# Altium schematic sheet 06.SchDoc
size 297 x 209 mm
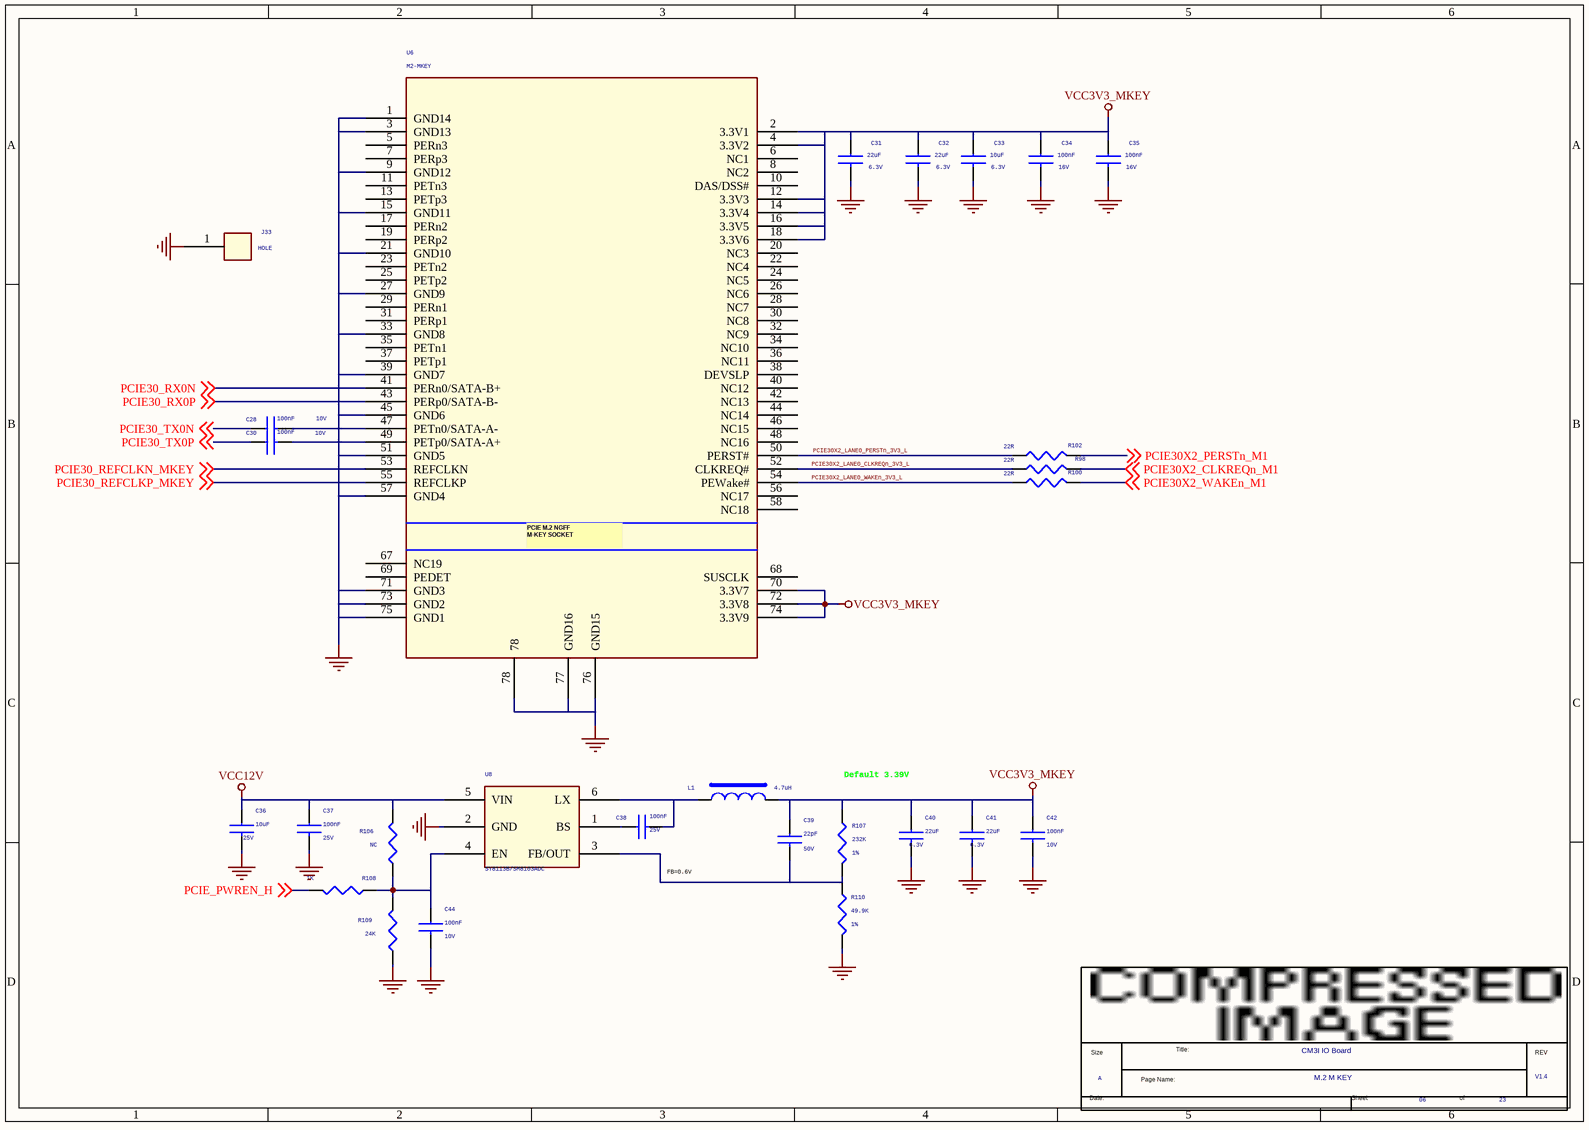
[diagram p0: 06.SchDoc]

## Parts
*  Page Count: 23  Page Number: 06  Page Size: A  Title: CM3I IO Board  RevCode: V1.4  Doc: M.2 M KEY  (hidden comment: radxa_1010)  (graphical)
C28  100nF  Voltage: 10V  [C0402]
C30  100nF  Voltage: 10V  [C0402]
C31  22uF  Voltage: 6.3V  [C0603]
C32  22uF  Voltage: 6.3V  [C0603]
C33  10uF  Voltage: 6.3V  [C0603]
C34  100nF  Voltage: 16V  [C0402]
C35  100nF  Voltage: 16V  [C0402]
C36  10uF  Voltage: 25V  [C1206]
C37  100nF  Voltage: 25V  [C0402]
C38  100nF  Voltage: 25V  [C0402]
C39  22pF  Voltage: 50V  [C0402]
C40  22uF  Voltage: 6.3V  [C0603]
C41  22uF  Voltage: 6.3V  [C0603]
C42  100nF  Voltage: 10V  [C0402]
C44  100nF  Voltage: 10V  [C0402]
J33  HOLE  [HOLE_5D5X2D7MM]
L1  4.7uH  [IND-4X4]
R98  22R  [R0402]
R100  22R  [R0402]
R102  22R  [R0402]
R106  NC  [R0402]
R107  232K  Tolerance: 1%  [R0402]
R108  1K  [R0402]
R109  24K  [R0402]
R110  49.9K  Tolerance: 1%  [R0402]
U6  M2-MKEY  [M2_NGFF_KEY_M_1]
U8  SY8113B/SM8103ADC  [SOT_23_6]

## Nets
GND: C31.2 C32.2 C33.2 C34.2 C35.2 C36.2 C37.2 C40.2 C41.2 C42.2 C44.2 J33.1 R109.2 R110.2 U6.1(GND14) U6.3(GND13) U6.9(GND12) U6.15(GND11) U6.21(GND10) U6.27(GND9) U6.33(GND8) U6.39(GND7) U6.45(GND6) U6.51(GND5) U6.57(GND4) U6.71(GND3) U6.73(GND2) U6.75(GND1) U6.76(GND15) U6.77(GND16) U6.78 U8.2(GND)
VCC3V3_MKEY: C31.1 C32.1 C33.1 C34.1 C35.1 C39.1 C40.1 C41.1 C42.1 L1.2 R107.1 U6.2(3.3V1) U6.4(3.3V2) U6.12(3.3V3) U6.14(3.3V4) U6.16(3.3V5) U6.18(3.3V6) U6.70(3.3V7) U6.72(3.3V8) U6.74(3.3V9)
VCC12V: C36.1 C37.1 R106.1 U8.5(VIN)
PCIE30_REFCLKN_MKEY: U6.53(REFCLKN) ; off-sheet PCIE30_REFCLKN_MKEY
PCIE30_REFCLKP_MKEY: U6.55(REFCLKP) ; off-sheet PCIE30_REFCLKP_MKEY
PCIE30_RX0N: U6.41(PERn0/SATA-B+) ; off-sheet PCIE30_RX0N
PCIE30_RX0P: U6.43(PERp0/SATA-B-) ; off-sheet PCIE30_RX0P
PCIE30_TX0N: C28.1 ; off-sheet PCIE30_TX0N
PCIE30_TX0P: C30.1 ; off-sheet PCIE30_TX0P
PCIE30X2_CLKREQn_M1: R98.1 ; off-sheet PCIE30X2_CLKREQn_M1
PCIE30X2_LANE0_CLKREQn_3V3_L: R98.2 U6.52(CLKREQ#)
PCIE30X2_LANE0_PERSTn_3V3_L: R102.2 U6.50(PERST#)
PCIE30X2_LANE0_WAKEn_3V3_L: R100.2 U6.54(PEWake#)
PCIE30X2_PERSTn_M1: R102.1 ; off-sheet PCIE30X2_PERSTn_M1
PCIE30X2_WAKEn_M1: R100.1 ; off-sheet PCIE30X2_WAKEn_M1
PCIE_PWREN_H: R108.1 ; off-sheet PCIE_PWREN_H
NetC28_2: C28.2 U6.47(PETn0/SATA-A-)
NetC30_2: C30.2 U6.49(PETp0/SATA-A+)
NetC38_1: C38.1 U8.1(BS)
NetC38_2: C38.2 L1.1 U8.6(LX)
NetC39_2: C39.2 R107.2 R110.1 U8.3(FB/OUT)
NetC44_1: C44.1 R106.2 R108.2 R109.1 U8.4(EN)

Not connected (* = marked no-connect by the designer): U6 5(PERn3) 6(NC1) 7(PERp3) 8(NC2) 10(DAS/DSS#) 11(PETn3) 13(PETp3) 17(PERn2) 19(PERp2) 20(NC3) 22(NC4) 23(PETn2) 24(NC5) 25(PETp2) 26(NC6) 28(NC7) 29(PERn1) 30(NC8) 31(PERp1) 32(NC9) 34(NC10) 35(PETn1) 36(NC11) 37(PETp1) 38(DEVSLP) 40(NC12) 42(NC13) 44(NC14) 46(NC15) 48(NC16) 56(NC17) 58(NC18) 67(NC19) 68(SUSCLK) 69(PEDET)

## Notes on the sheet
- Default 3.39V
- FB=0.6V
- (in symbol M_5.2 NGFF EKEY SOCKET) PCIE M.2 NGFF / M-KEY SOCKET
- (in symbol radxa_1010) Title:; Size; REV; Page Name:; Date:; Sheet; of

## Library data of the parts
C28 = CAP NP_0: cap,100.00nF,+/-10%,10V,X5R,C0201; Manufacturer: TDK; RK PN: C0603X5R1A104K030BC; Priority: A; Tolerance: 10%; Dielectric: X5R; Part Type: C0201; Manufacturer PN: C0603X5R1A104K030BC; Created by: JJJ
C30 = CAP NP_0: cap,100.00nF,+/-10%,10V,X5R,C0201; Manufacturer PN: C0603X5R1A104K030BC; Manufacturer: TDK; Tolerance: 10%; Priority: A; Dielectric: X5R; Created by: JJJ; Part Type: C0201; RK PN: C0603X5R1A104K030BC
C31 = CAP NP_0: cap,22.00uF,+/-20%,6.3V,X5R,C0603; Manufacturer PN: C1608X5R0J226M080AC; Manufacturer: TDK; Tolerance: 20%; Priority: A; Dielectric: X5R; Created by: JJJ; Part Type: C0603; RK PN: C1608X5R0J226M080AC
C32 = CAP NP_0: cap,22.00uF,+/-20%,6.3V,X5R,C0603; Manufacturer: TDK; RK PN: C1608X5R0J226M080AC; Priority: A; Tolerance: 20%; Dielectric: X5R; Part Type: C0603; Manufacturer PN: C1608X5R0J226M080AC; Created by: JJJ
C33 = CAP NP_0: cap,10.00uF,+/-10%,6.3V,X5R,C0603; Manufacturer: TDK; RK PN: C1608X5R0J106K080AB; Priority: A; Tolerance: 10%; Dielectric: X5R; Part Type: C0603; Manufacturer PN: C1608X5R0J106K080AB; Created by: JJJ
C34 = CAP NP_0: cap,100.00nF,+/-10%,16V,X5R,C0402; Manufacturer: TDK; RK PN: C1005X5R1C104K050BA; Priority: A; Tolerance: 10%; Dielectric: X5R; Part Type: C0402; Manufacturer PN: C1005X5R1C104K050BA; Created by: JJJ
C35 = CAP NP_0: cap,100.00nF,+/-10%,16V,X5R,C0402; Manufacturer PN: C1005X5R1C104K050BA; Manufacturer: TDK; Tolerance: 10%; Priority: A; Dielectric: X5R; Created by: JJJ; Part Type: C0402; RK PN: C1005X5R1C104K050BA
C36 = CAP NP_0: cap,10.00uF,+/-10%,25V,X5R,C1206; Manufacturer PN: C3216X5R1E106K085AC; Manufacturer: TDK; Tolerance: 10%; C_Voltage: 6.3V; Priority: A; Dielectric: X5R; Created by: JJJ; Part Type: C1206; RK PN: C3216X5R1E106K085AC
C37 = CAP NP_0: cap,100.00nF,+/-10%,25V,X5R,C0402; Manufacturer: TDK; RK PN: C1005X5R1E104K050BC; Priority: A; Tolerance: 10%; Dielectric: X5R; Part Type: C0402; Manufacturer PN: C1005X5R1E104K050BC; Created by: JJJ
C38 = CAP NP_0: cap,100.00nF,+/-10%,25V,X5R,C0402; Manufacturer PN: C1005X5R1E104K050BC; Manufacturer: TDK; C_Voltage: 6.3V; Tolerance: 10%; Priority: A; Number: 37; Dielectric: X5R; Created by: JJJ; Part Type: C0402; RK PN: C1005X5R1E104K050BC
C39 = CAP NP_0: cap,22.00pF,+/-5%,50V,C0G,C0402; Manufacturer: TDK; Manufacturer PN: C1005C0G1H220J050BA; Tolerance: 5%; Priority: A; Dielectric: C0G; Created by: JJJ; Part Type: C0402; RK PN: C1005C0G1H220J050BA
C40 = CAP NP_0: cap,22.00uF,+/-10%,10V,X5R,C0805; Manufacturer: TDK; RK PN: C2012X5R1A226K125AB; Priority: A; Tolerance: 10%; Dielectric: X5R; Part Type: C0805; C_Voltage: 6.3V; Manufacturer PN: C2012X5R1A226K125AB; Created by: JJJ
C41 = CAP NP_0: cap,22.00uF,+/-10%,10V,X5R,C0805; Manufacturer PN: C2012X5R1A226K125AB; Manufacturer: TDK; Tolerance: 10%; Priority: A; Dielectric: X5R; Created by: JJJ; C_Voltage: 6.3V; Part Type: C0805; RK PN: C2012X5R1A226K125AB
C42 C44 = CAP NP_0: cap,100.00nF,+/-10%,10V,X5R,C0402; Manufacturer PN: C1005X5R1A104K050BA; Manufacturer: TDK; C_Voltage: 6.3V; Tolerance: 10%; Priority: A; Number: 37; Dielectric: X5R; Created by: JJJ; Part Type: C0402; RK PN: C1005X5R1A104K050BA
J33 = CON1
L1 = INDUCTORS OF FERRITE_Dup1: Power Inductor,4.7uH,0.2,IND_606045; Manufacturer: sunlord; DC Resistor: 0.02ohm; Isat: 4.97A; RK PN: SWPA6045S4R7MT; Priority: A; Tolerance: 20%; Irms: 3.3A; Resonace frequency: 24M; Part Type: POWER_IND; Manufacturer PN: SWPA6045S4R7MT; Created by: YWQ
R98 = RESISTOR_0_Dup1: 通用厚膜电阻,22R,+/-5%,R0402,1/16W.; Manufacturer: YAGEO; Tolerance: 5%; RK PN: RC0402JR-0722RL; Priority: A; Wattage: 1/16W; Part Type: 通用厚膜电阻; Manufacturer PN: RC0402JR-0722RL; Created by: YTL
R100 R102 = RESISTOR_0_Dup1: 通用厚膜电阻,22R,+/-5%,R0402,1/16W.; Manufacturer PN: RC0402JR-0722RL; Manufacturer: YAGEO; Tolerance: 5%; Wattage: 1/16W; Priority: A; Created by: YTL; Part Type: 通用厚膜电阻; RK PN: RC0402JR-0722RL
R106 R109 = RESISTOR_0_Dup1: 通用厚膜电阻,24K,+/-5%,R0402,1/16W.; Manufacturer PN: RC0402JR-0724KL; Manufacturer: YAGEO; Tolerance: 5%; Wattage: 1/16W; Priority: A; Created by: YTL; Part Type: 通用厚膜电阻; RK PN: RC0402JR-0724KL
R107 = RESISTOR_0_Dup1: 通用厚膜电阻,232K,+/-1%,R0402,1/16W.; Manufacturer PN: RC0402FR-07232KL; Manufacturer: YAGEO; Wattage: 1/16W; Priority: A; Created by: YTL; Part Type: 通用厚膜电阻; RK PN: RC0402FR-07232KL
R108 = RESISTOR_0_Dup1: 通用厚膜电阻,100K,+/-5%,R0402,1/16W.; Manufacturer: YAGEO; Tolerance: 5%; RK PN: RC0402JR-07100KL; Priority: A; Wattage: 1/16W; Part Type: 通用厚膜电阻; Manufacturer PN: RC0402JR-07100KL; Created by: YTL
R110 = RESISTOR_0_Dup1: 通用厚膜电阻,49K9,+/-1%,R0402,1/16W.; Manufacturer PN: RC0402FR-0749K9L; Manufacturer: YAGEO; Wattage: 1/16W; Priority: A; Created by: YTL; Part Type: 通用厚膜电阻; RK PN: RC0402FR-0749K9L
U6 = M_5.2 NGFF EKEY SOCKET
U8 = DCDC_SY8113: Manufacturer: Silergy（矽力杰）; Priority: A; RK PN: SY8113B; Part Type: DCDC; Manufacturer PN: SY8113B; Created by: JJJ
* = radxa_1010: Page Create Date: March  8, 1995